# Altium project WiWi_USBStick.PrjPcb (part 3 of 5)

## Sheet 13-ESP32C6.SchDoc
size B; SheetNumber: 8; SheetTotal: 14
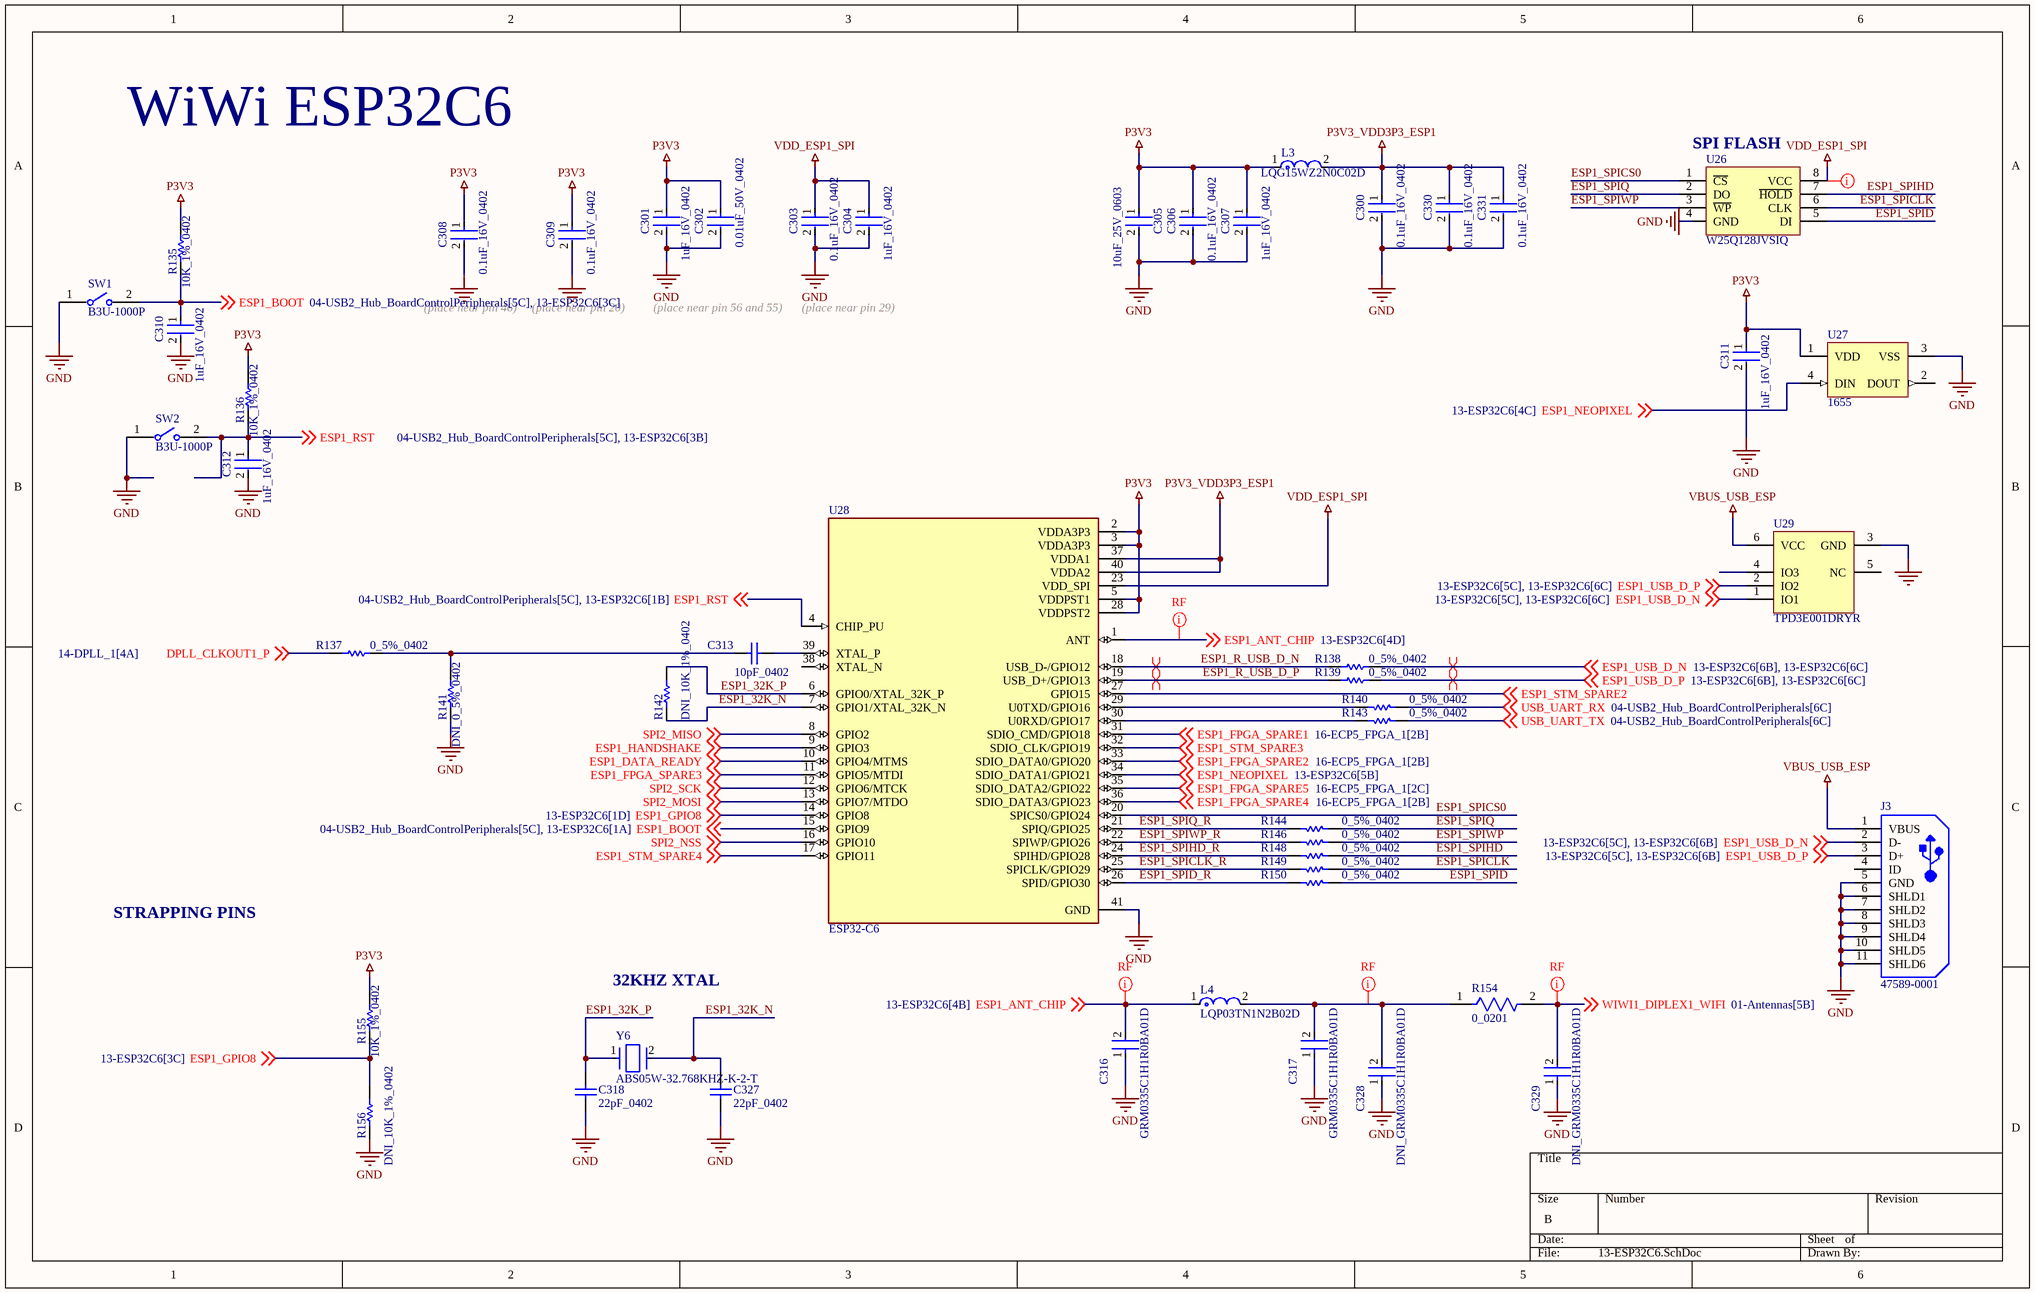
[diagram p7: 13-ESP32C6.SchDoc]

### Parts
C300  0.1uF_16V_0402  [FP-C0402-BB-MFG]
C301  1uF_16V_0402  [FP-0402-L_1_0_0_05-W_0_5-IPC_A]
C302  0.01uF_50V_0402  [FP-GCM155-0_05-IPC_C]
C303  0.1uF_16V_0402  [FP-C0402-BB-MFG]
C304  1uF_16V_0402  [FP-0402-L_1_0_0_05-W_0_5-IPC_A]
C305  10uF_25V_0603  [FP-CL10-IPC_C]
C306  0.1uF_16V_0402  [FP-C0402-BB-MFG]
C307  1uF_16V_0402  [FP-0402-L_1_0_0_05-W_0_5-IPC_A]
C308  0.1uF_16V_0402  [FP-C0402-BB-MFG]
C309  0.1uF_16V_0402  [FP-C0402-BB-MFG]
C310  1uF_16V_0402  [FP-0402-L_1_0_0_05-W_0_5-IPC_A]
C311  1uF_16V_0402  [FP-0402-L_1_0_0_05-W_0_5-IPC_A]
C312  1uF_16V_0402  [FP-0402-L_1_0_0_05-W_0_5-IPC_A]
C313  10pF_0402  [CAPC1005X55X25ML05T05]
C316  GRM0335C1H1R0BA01D  [FP-GRM033-0_03-IPC_C]
C317  GRM0335C1H1R0BA01D  [FP-GRM033-0_03-IPC_C]
C318  22pF_0402  [CAPC1005X55X25ML05T05]
C327  22pF_0402  [CAPC1005X55X25ML05T05]
C328  DNI_GRM0335C1H1R0BA01D  [FP-GRM033-0_03-IPC_C]  (no BOM)
C329  DNI_GRM0335C1H1R0BA01D  [FP-GRM033-0_03-IPC_C]  (no BOM)
C330  0.1uF_16V_0402  [FP-C0402-BB-MFG]
C331  0.1uF_16V_0402  [FP-C0402-BB-MFG]
J3  47589-0001  [MOLX-47589-0001_V]
L3  LQG15WZ2N0C02D  [FP-LQG15WH_02-IPC_B]
L4  LQP03TN1N2B02D  [FP-LQP03TG_02-IPC_A]
R135  10K_1%_0402  [RESC1005X40X25NL10T10]
R136  10K_1%_0402  [RESC1005X40X25NL10T10]
R137  0_5%_0402  [RESC1005X40X25NL05T10]
R138  0_5%_0402  [RESC1005X40X25NL05T10]
R139  0_5%_0402  [RESC1005X40X25NL05T10]
R140  0_5%_0402  [RESC1005X40X25NL05T10]
R141  DNI_0_5%_0402  [RESC1005X40X25NL05T10]  (no BOM)
R142  DNI_10K_1%_0402  [RESC1005X40X25NL10T10]  (no BOM)
R143  0_5%_0402  [RESC1005X40X25NL05T10]
R144  0_5%_0402  [RESC1005X40X25NL05T10]
R146  0_5%_0402  [RESC1005X40X25NL05T10]
R148  0_5%_0402  [RESC1005X40X25NL05T10]
R149  0_5%_0402  [RESC1005X40X25NL05T10]
R150  0_5%_0402  [RESC1005X40X25NL05T10]
R154  0_0201  [FP-RC_L0201-MFG]
R155  10K_1%_0402  [RESC1005X40X25NL10T10]
R156  DNI_10K_1%_0402  [RESC1005X40X25NL10T10]  (no BOM)
SW1  B3U-1000P  [FP-B3U-1000P-MFG]
SW2  B3U-1000P  [FP-B3U-1000P-MFG]
U26  W25Q128JVSIQ  [IC_W25Q128JVSIQ]
U27  1655  [ADA-RGB-1655_V]
U28  ESP32-C6  [QFN40P500X500X90-41N]
U29  TPD3E001DRYR  [DRY0006A]
Y6  ABS05W-32.768KHZ-K-2-T  [FP-ABS05W-MFG]

### Nets
GND: C300.2 C301.2 C302.2 C303.2 C304.2 C305.2 C306.2 C307.2 C308.2 C309.2 C310.2 C311.2 C312.2 C316.1 C317.1 C318.1 C327.1 C328.1 C329.1 C330.2 C331.2 J3.5(GND) J3.6(SHLD1) J3.7(SHLD2) J3.8(SHLD3) J3.9(SHLD4) J3.10(SHLD5) J3.11(SHLD6) R141.1 R156.1 SW1.1 SW2.1 U26.4(GND) U27.3(VSS) U28.41(GND) U29.3(GND)
P3V3: C301.1 C302.1 C305.1 C306.1 C307.1 C308.1 C309.1 C311.1 L3.1 R135.2 R136.2 R155.2 U27.1(VDD) U28.2(VDDA3P3) U28.3(VDDA3P3) U28.5(VDDPST1) U28.28(VDDPST2)
P3V3_VDD3P3_ESP1: C300.1 C330.1 C331.1 L3.2 U28.37(VDDA1) U28.40(VDDA2)
VBUS_USB_ESP: J3.1(VBUS) U29.6(VCC)
VDD_ESP1_SPI: C303.1 C304.1 U26.8(VCC) U28.23(VDD_SPI)
DPLL_CLKOUT1_P: R137.1 ; off-sheet DPLL_CLKOUT1_P
ESP1_32K_N: C327.2 R142.1 U28.7(GPIO1/XTAL_32K_N) Y6.2
ESP1_32K_P: C318.2 R142.2 U28.6(GPIO0/XTAL_32K_P) Y6.1
ESP1_ANT_CHIP: C316.2 L4.1 U28.1(ANT) ; off-sheet ESP1_ANT_CHIP
ESP1_BOOT: C310.1 R135.1 SW1.2 U28.15(GPIO9) ; off-sheet ESP1_BOOT
ESP1_DATA_READY: U28.10(GPIO4/MTMS) ; off-sheet ESP1_DATA_READY
ESP1_FPGA_SPARE1: U28.31(SDIO_CMD/GPIO18) ; off-sheet ESP1_FPGA_SPARE1
ESP1_FPGA_SPARE2: U28.33(SDIO_DATA0/GPIO20) ; off-sheet ESP1_FPGA_SPARE2
ESP1_FPGA_SPARE3: U28.11(GPIO5/MTDI) ; off-sheet ESP1_FPGA_SPARE3
ESP1_FPGA_SPARE4: U28.36(SDIO_DATA3/GPIO23) ; off-sheet ESP1_FPGA_SPARE4
ESP1_FPGA_SPARE5: U28.35(SDIO_DATA2/GPIO22) ; off-sheet ESP1_FPGA_SPARE5
ESP1_GPIO8: R155.1 R156.2 U28.14(GPIO8) ; off-sheet ESP1_GPIO8
ESP1_HANDSHAKE: U28.9(GPIO3) ; off-sheet ESP1_HANDSHAKE
ESP1_NEOPIXEL: U27.4(DIN) U28.34(SDIO_DATA1/GPIO21) ; off-sheet ESP1_NEOPIXEL
ESP1_R_USB_D_N: R138.1 U28.18(USB_D-/GPIO12)
ESP1_R_USB_D_P: R139.1 U28.19(USB_D+/GPIO13)
ESP1_RST: C312.1 R136.1 SW2.2 U28.4(CHIP_PU) ; off-sheet ESP1_RST
ESP1_SPICLK: R149.1 U26.6(CLK)
ESP1_SPICLK_R: R149.2 U28.25(SPICLK/GPIO29)
ESP1_SPICS0: U26.1(~{CS}) U28.20(SPICS0/GPIO24)
ESP1_SPID: R150.1 U26.5(DI)
ESP1_SPID_R: R150.2 U28.26(SPID/GPIO30)
ESP1_SPIHD: R148.1 U26.7(~{HOLD})
ESP1_SPIHD_R: R148.2 U28.24(SPIHD/GPIO28)
ESP1_SPIQ: R144.1 U26.2(DO)
ESP1_SPIQ_R: R144.2 U28.21(SPIQ/GPIO25)
ESP1_SPIWP: R146.1 U26.3(~{WP})
ESP1_SPIWP_R: R146.2 U28.22(SPIWP/GPIO26)
ESP1_STM_SPARE2: U28.27(GPIO15) ; off-sheet ESP1_STM_SPARE2
ESP1_STM_SPARE3: U28.32(SDIO_CLK/GPIO19) ; off-sheet ESP1_STM_SPARE3
ESP1_STM_SPARE4: U28.17(GPIO11) ; off-sheet ESP1_STM_SPARE4
ESP1_USB_D_N: J3.2(D-) R138.2 U29.1(IO1) ; off-sheet ESP1_USB_D_N
ESP1_USB_D_P: J3.3(D+) R139.2 U29.2(IO2) ; off-sheet ESP1_USB_D_P
SPI2_MISO: U28.8(GPIO2) ; off-sheet SPI2_MISO
SPI2_MOSI: U28.13(GPIO7/MTDO) ; off-sheet SPI2_MOSI
SPI2_NSS: U28.16(GPIO10) ; off-sheet SPI2_NSS
SPI2_SCK: U28.12(GPIO6/MTCK) ; off-sheet SPI2_SCK
USB_UART_RX: R140.1 ; off-sheet USB_UART_RX
USB_UART_TX: R143.1 ; off-sheet USB_UART_TX
WIWI1_DIPLEX1_WIFI: C329.2 R154.2 ; off-sheet WIWI1_DIPLEX1_WIFI
NetC313_1: C313.1 R137.2 R141.2
NetC313_2: C313.2 U28.39(XTAL_P)
NetC317_2: C317.2 C328.2 L4.2 R154.1
NetR140_2: R140.2 U28.29(U0TXD/GPIO16)
NetR143_2: R143.2 U28.30(U0RXD/GPIO17)

Not connected (* = marked no-connect by the designer): J3 4(ID); U27 2(DOUT); U28 38(XTAL_N); U29 4(IO3) 5(NC)

### Layout directives
net class Power: VDD_ESP1_SPI
net class RF: ESP1_ANT_CHIP, NetC317_2, WIWI1_DIPLEX1_WIFI
differential pair: ESP1_R_USB_D_N, ESP1_R_USB_D_P, ESP1_USB_D_N, ESP1_USB_D_P

### Notes on the sheet
- WiWi ESP32C6
- (near U26) SPI FLASH
- (place near pin 46)
- (place near pin 20)
- (place near pin 56 and 55)
- (place near pin 29)
- STRAPPING PINS
- 32KHZ XTAL

### Library data of the parts
C300 C303 C306 C308 C309 C330 C331 = CMP-1034-02068-3: CAP CER 0.1UF 16V 5% X7R 0402; Manufacturer: Kemet; Manufacturer Part Number: C0402C104J4RACTU; Value: 0.10 μF; Temperature Coefficient: 15%; Tolerance: 0.05; Material: Ceramic; ComponentLink2URL: https://content.kemet.com/datasheets/KEM_C1002_X7R_SMD.pdf; Automotive: No; Device Class L2: Capacitors; Temperature: -55°C to +125°C; RoHS: TRUE; Voltage Rating: 16 V; ComponentLink2Description: Datasheet; Device Class L3: Ceramic Capacitors; Temperature Range Low: -55°C; Ipc Land Pattern Name: CAPC10050X50; Device Class L1: Passive Components; Temperature Range High: +125°C; Package: C0402-BB; Capacitance: 0.10 μF; Category: Cap; Mouser Description: CAP CER 0.1UF 16V X7R 0402; Height: 0.55mm; Digikey Description: CAP CER 0.1UF 16V 5% X7R 0402; Octopart: https://octopart.com/c0402c104j4ractu-kemet-12573893; Temperature Characteristic: X7R; Lead Free: Yes
C301 C304 C307 C310-C312 = CMP-14477-000104-2: None; Tolerance: 10%; Voltage Rating: 16V; Dielectric: X5R; Capacitance: 1uF; Packaging: Tape and Reel; Depth: 0.5mm; Mount: Surface Mount; Thickness: 0.022inch; Package Quantity: 1; Min Operating Temperature: -55°C; Series: M; Voltage Rating (DC): 16V; Termination: SMD/SMT; Case/Package: 0402; Number of Pins: 2; Case Code (Imperial): 0402; Length: 1mm; Halogen Free: Halogen Free; Case Code (Metric): 1005; Width: 0.02inch; RoHS Compliant: Yes; Radiation Hardening: No; Max Operating Temperature: 85°C; Height: 0.5mm; Construction: Flat
C302 = CMP-2008-03723-3: Ceramic Capacitor for Automotive 10nF ±10% 50VDC X7R 0402 Paper T/R; Voltage Rating (DC): 50V; Min Operating Temperature: -55°C; Radiation Hardening: No; Mount: Surface Mount; Thickness: 0.022inch; Package Quantity: 1; Case Code (Imperial): 0402; Lead Free: Lead Free; Case/Package: 0402; Depth: 0.5mm; Termination: SMD/SMT; Tolerance: 10%; Voltage: 50V; Packaging: Tape and Reel; Width: 0.02inch; REACH SVHC: No SVHC; Height: 0.5mm; Max Operating Temperature: 125°C; Case Code (Metric): 1005; Voltage Rating: 50V; Capacitance: 10nF; Ratings: AEC-Q200; Length: 1mm; Dielectric: X7R
C305 = CMP-13271-004224-1: Cap Ceramic 10uF 25V X5R ±20% Pad SMD 0603 +85°C T/R; Width: 0.031inch; Voltage Rating: 25V; Length: 0.063inch; Case Code (Metric): 1608; Dielectric: X5R; Termination: Wraparound; Capacitance: 10uF; Lead Free: Lead Free; Mount: Surface Mount; Package Quantity: 1; Case Code (Imperial): 0603; Thickness: 0.035inch; Packaging: Tape and Reel; Contact Plating: Tin; Min Operating Temperature: -55°C; Tolerance: 20%; Max Operating Temperature: 85°C; Case/Package: 0603
C313 = CMP-2100-03589-1: Chip Capacitor, 10 pF, +/- 5%, 50 V, -55 to 125 degC, 0402 (1005 Metric), RoHS, Tape and Reel; Manufacturer: Yageo; Insulation Resistance: 100GR; Voltage Rating (DC): 50V; Dielectric Material: Ceramic; Temperature Coefficient: 30ppm/degC; Dielectric: C0G; Capacitance: 10pF; Termination: SMD/SMT; Package Reference: 0402; Lead Free: LeadFree; Composition: Ceramic; Tolerance: 5%; Case Code (Metric): 1005; Voltage Rating: 50V; Packaging: TapeandReel; Manufacturer URL: http://www.yageo.com/; REACH SVHC: NoSVHC; Max Operating Temperature: 125degC; Length: 1mm; Mount: SurfaceMount; Depth: 0.5mm; Min Operating Temperature: -55degC; Number of Pins: 2; Width: 0.02inch; Datasheet Version: Rev. 14, 07/2016; Package Quantity: 1; Datasheet URL: http://www.yageo.com/documents/recent/UPY-GP_NP0_16V-to-50V_14.pdf; Case Code (Imperial): 0402; RoHSCompliant: True; Radiation Hardening: No; Height: 0.5mm; Case/Package: 0402; Thickness: 0.022inch; Package Description: 2-Pin Surface Mount Device, Body 1 x 0.5 mm; Voltage: 50V
C316 C317 C328 C329 = CMP-2010-01509-2: Chip Multilayer Ceramic Capacitors for General Purpose, 0201, 1.0pF, C0G, 30ppm/°C, 0.1pF, 50V; Capacitance: 1pF; Termination: SMD/SMT; Depth: 0.3mm; Mount: Surface Mount; Case Code (Metric): 0603; Length: 0.024inch; Voltage Rating: 50V; Voltage Rating (DC): 50V; Width: 0.012inch; Lead Free: Lead Free; Dielectric: C0G; Thickness: 0.013inch; Packaging: Tape and Reel; Case Code (Imperial): 0201; Case/Package: 0201; Package Quantity: 15000; Min Operating Temperature: -55°C; Max Operating Temperature: 125°C
C318 C327 = CMP-2100-03590-1: Chip Capacitor, 22 pF, +/- 5%, 50 V, -55 to 125 degC, 0402 (1005 Metric), RoHS, Tape and Reel; Manufacturer: Yageo; Voltage Rating: 50V; Dielectric Material: Ceramic; Capacitance: 22pF; Temperature Coefficient: 30ppm/degC; Dielectric: C0G; Insulation Resistance: 100GR; Datasheet URL: http://www.yageo.com/NewPortal/yageodocoutput?fileName=/pdf/MLCC/UPY-GP_NP0_16V-to-50V_14.pdf; Depth: 0.5mm; Number of Pins: 2; Height: 0.5mm; Min Operating Temperature: -55degC; REACH SVHC: NoSVHC; Max Operating Temperature: 125degC; Voltage Rating (DC): 50V; Composition: Ceramic; Packaging: TapeandReel; Package Quantity: 1; Package Reference: 0402; Length: 1mm; Radiation Hardening: No; Package Description: 2-Pin Surface Mount Device, Body 1 x 0.5 mm; RoHSCompliant: True; Thickness: 0.022inch; Manufacturer URL: http://www.yageo.com/; Mount: SurfaceMount; Case Code (Metric): 1005; Case/Package: 0402; Tolerance: 5%; Termination: SMD/SMT; Width: 0.02inch; Datasheet Version: Rev. 14, 07/2016; Lead Free: LeadFree; Case Code (Imperial): 0402
J3 = CMP-2000-05610-1: Right Angle Female Type AB Micro USB Connector, 30 V, 1.8 A, -30 to 85 degC, RoHS, Tape and Reel; Number of Ports: 1Port; Current Rating: 1.8A; Brand: Molex; Connector Type: MicroUSBTypeABreceptacle; Number of Contacts: 5Contact; Voltage Rating: 30VAC; Color: Black; Product: MicroUSBTypeABConnectors; Package URL: http://www.molex.com/pdm_docs/sd/475890001_sd.pdf; Contact Plating: Gold; Datasheet URL: http://www.molex.com/webdocs/datasheets/pdf/en-us/0475890001_IO_CONNECTORS.pdf; Operating Temperature Range: -20Cto+85C; Termination Style: SMD/SMT; Mounting Angle: Right; Package Reference: 47589-0001; Gender: Female; Package Description: Micro USB Connector, Pitch 0.65 mm, 5 Positions, Body 7.5 x 5.6 mm; Mounting Technology: SurfaceMount; Contact Material: CopperAlloy; Packaging: Reel; RoHS: True; Standard: USB; Manufacturer URL: http://www.molex.com/; Manufacturer: Molex; Datasheet Version: 12/2016; Product Category: USBConnectors; Series: 47589
L3 = CMP-06042-012509-1: Multilayer type Inductor for Automotive 2nH ±0.2nH 0.05Ω 1000mA 0402; Test Frequency: 100MHz; Shielding: Unshielded; DC Resistance (DCR): 50mR; Self Resonant Frequency: 8GHz; Current Rating: 1A; Core Material: Air; Case Code (Metric): 1005; Case/Package: 0402; Mount: Surface Mount; Min Operating Temperature: -55°C; Inductance: 2nH; Ratings: AEC-Q200; Max Operating Temperature: 125°C; Packaging: Cut Tape; Case Code (Imperial): 0402
L4 = CMP-06042-001577-1: Film type RF Inductor 1.2nH ±0.1nH 750mA 0.1Ω 0201 (0603); DC Resistance (DCR): 100mR; Current: 600mA; Core Material: Non-Magnetic; Shielding: Unshielded; Q Factor: 14; Test Frequency: 500MHz; Self Resonant Frequency: 6GHz; Inductance: 1.2nH; Mount: Surface Mount; Package Quantity: 15000; Length: 0.024inch; Resistor Type: Thin Film; Min Operating Temperature: -55°C; Depth: 0.33mm; Height: 0.012inch; Max DC Current: 750mA; Width: 0.012inch; Case/Package: 0201; Case Code (Imperial): 0201; Lead Free: Lead Free; Military Standard: Not; Termination: SMD/SMT; Max Operating Temperature: 125°C; DC Current: 750mA; Packaging: Tape and Reel; Case Code (Metric): 0603; Height - Seated (Max): 0.013inch; REACH SVHC: No SVHC; Radiation Hardening: No; Current Rating: 750mA
R135 R136 R142 R155 R156 = CMP-2002-04694-1: Manufacturer: Bourns; Part Number: CR0402-FX-1002GLF
R137-R141 R143 R144 R146 R148-R150 = CMP-2002-06457-1: Manufacturer: Panasonic; Part Number: ERJ-U020R00X
R154 = CMP-03412-023265-1: RES SMD 0 OHM JUMPER 1/20W 0201; Manufacturer: Yageo; Manufacturer Part Number: RC0201JR-070RL; Power Rating: 50mW; Value: 0Ω; Temperature Coefficient: 200ppm/°C; Voltage Rating: 25V; Tolerance: 5%; Octopart: https://octopart.com/rc0201jr-070rl-yageo-43171986; ComponentLink2URL: http://www.yageo.com/documents/recent/PYu-RC_Group_51_RoHS_L_10.pdf; Device Class L2: Resistors; Series: RC_L; Ipc Land Pattern Name: RESC6030X23; Temperature: -55°C to +125°C; Mouser Description: Thick Film Resistors ZERO OHM JUMPER; Footprint Url: http://www.yageo.com/exep/pages/download/literatures/PYu-R_Mount_10.pdf; RoHS: TRUE; Package: RC_L0201; Device Class L3: Chip SMD Resistors; Temperature Range Low: -55°C; Composition: Thick Film; ComponentLink2Description: Datasheet; Height: 0.26mm; Device Class L1: Passive Components; Category: Res; Resistance: 0Ω; Temperature Range High: +125°C; Automotive: No; Lead Free: Yes; Digikey Description: RES SMD 0 OHM JUMPER 1/20W 0201
SW1 SW2 = CMP-2100-03586-2: SWITCH TACTILE SPST-NO 0.05A 12V; Contact Resistance: 100mR; Operating Force: 1.5N; Max Current Rating: 50mA; Switch Travel: 0.15mm; Actuator Type: Standard; Mechanical Life: 200000Cycles; Ratings: Dust Proof; Illumination Type: Non-Illuminated; Throw Configuration: SPST; Actuator Length: 0.4mm; Switch Function: Off-Mom; Height: 1.2mm; Width: 3mm; Weight: 0.000776oz; Contact Material: Silver; Max Voltage Rating (DC): 12V; Insulation Resistance: 100MR; Lead Free: Lead Free; Current Rating: 50mA; Termination: SMD/SMT; Length: 4mm; Voltage Rating (DC): 12V; Contact Current Rating: 50mA; Orientation: Straight; Depth: 2.5mm; Max Operating Temperature: 70°C; Packaging: Tape and Reel; Min Operating Temperature: -25°C; Package Quantity: 1; Mount: Surface Mount; Electrical Life: 200000Cycles
U26 = IC_W25Q128JVSIQ: NOR Flash Serial (SPI, Dual SPI, Quad SPI) 3.3V 128M-bit 16M x 8 6ns 8-Pin SOIC Tube; Manufacturer: Winbond; Memory Format: Non-Volatile,FLASH; Frequency: 133MHz; Memory Size: 128Mb; Supplier 1: Digi-Key; Manufacturer Part Number: W25Q128JVSIQ; RoHS: Yes; Category: Flash; Stock 1: 154352; Pricing 1: 1=1.71, 10=1.562, 25=1.52, 50=1.5124, 100=1.3519, 250=1.348, 500=1.32762, 1000=1.27127, 5000=1.18359 (USD); Mounting Technology: Surface Mount; Case/Package: SOIC; Min Operating Temperature: -40°C; Max Operating Temperature: 85°C; Packaging: Tray; Series: SpiFlash®; RoHS Compliant: Yes; ComponentLink1URL: http://www.winbond.com/resource-files/w25q128jv%20revf%2003272018%20plus.pdf?src-supplier=Digi-Key; ComponentLink1Description: http://www.winbond.com/resource-files/w25q128jv%20revf%2003272018%20plus.pdf?src-supplier=Digi-Key; Supplier Part Number 1: W25Q128JVSIQ-ND
U27 = CMP-2000-05026-1: Intelligent Control LED Integrated Light Source, 3.5 to 5.3 V, -25 to 80 degC, 4-Pin SMD, RoHS, Tape and Reel; Manufacturer: Adafruit-Industries-LLC; Number of LEDs: 10; Configuration: Discrete; Utilized LED: WS2812(5050); Datasheet URL: http://datasheet.octopart.com/ADA1655-Adafruit-Industries-datasheet-32028139.pdf; Series: Neopixel; Interface: -; Package Description: 4-Pin Surface Mount Device, Body 5 x 5 mm; Color: Red,Green,Blue(RGB); Category: Optoelectronics; Controller Type: -; Package Reference: 1655; Manufacturer URL: https://www.adafruit.com/; Mounting Type: SurfaceMount; Datasheet Version: May-13; Size / Dimension: 5.00mmLx5.00mmW; Family: Addressable,Specialty
U28 = ESP32-C6: IC RF TxRx Only Bluetooth, WiFi Bluetooth v5.0, Thread, ZigbeeÂ® 2.412GHz ~ 2.484GHz 40-VFQFN Exposed Pad; MF: Espressif Systems; SnapEDA_Link: https://www.snapeda.com/parts/ESP32-C6/Espressif+Systems/view-part/?ref=snap; Package: None; Value: *; MP: ESP32-C6; Check_prices: https://www.snapeda.com/parts/ESP32-C6/Espressif+Systems/view-part/?ref=eda
U29 = CMP-0326-00032-3: Low-Capacitance + / - 15 kV ESD-Protection Array for High-Speed Data Interfaces, 3 Channels, -40 to +85 degC, 6-pin SON (DRY), Green (RoHS & no Sb/Br); Manufacturer: Texas Instruments; USB High Speed: TRUE; SubFamily: ESD Solution; IO Capacitance(Typ)(pF): 1.5; IEC 61000-4-2 Contact(+/- kV): 8; IO Leakage Current(nA): Jan-00; Breakdown Voltage(Min)(V): 11; IEC 61000-4-2 Air-Gap(+/- kV): 15; DatasheetVersion: SLLS683D; Mounting Technology: Surface Mount; ComponentLink1URL: http://www.ti.com/; PackageReference: DRY0006A; ComponentLink2URL: http://www.ti.com/general/docs/lit/getliterature.tsp?genericPartNumber=TPD3E001&fileType=pdf; ComponentLink2Description: Datasheet; ComponentLink3Description: URL Link1; PackageDescription: 6-Pin Plastic Small Outline No-Lead, 1 x 1.45 x 0.6 mm Body, 0.5 mm Pitch; ComponentLink1Description: Manufacturer URL; PackageVersion: revF, Dec-2011; PartNumber: TPD3E001DRYR; Eco-Plan: Green (RoHS & no Sb/Br); ComponentLink3URL: SamplesURL:http://www.ti.com/product/tpd3e001#samples
Y6 = CMP-27762-015607-1: Crystal 32.768kHz ±20ppm (Tol) 4pF 85kΩ 2-Pin SMD T/R; ESR (Equivalent Series Resistance): 85kR; Frequency Tolerance: 20ppm; Mount: Surface Mount; Load Capacitance: 4pF; Case/Package: SMD/SMT; Packaging: Cut Tape; Frequency: 32.768kHz; Series: ABS05W; Min Operating Temperature: -40°C; Max Operating Temperature: 125°C

## Sheet 14-DPLL_1.SchDoc
size C; SheetNumber: 9; SheetTotal: 14
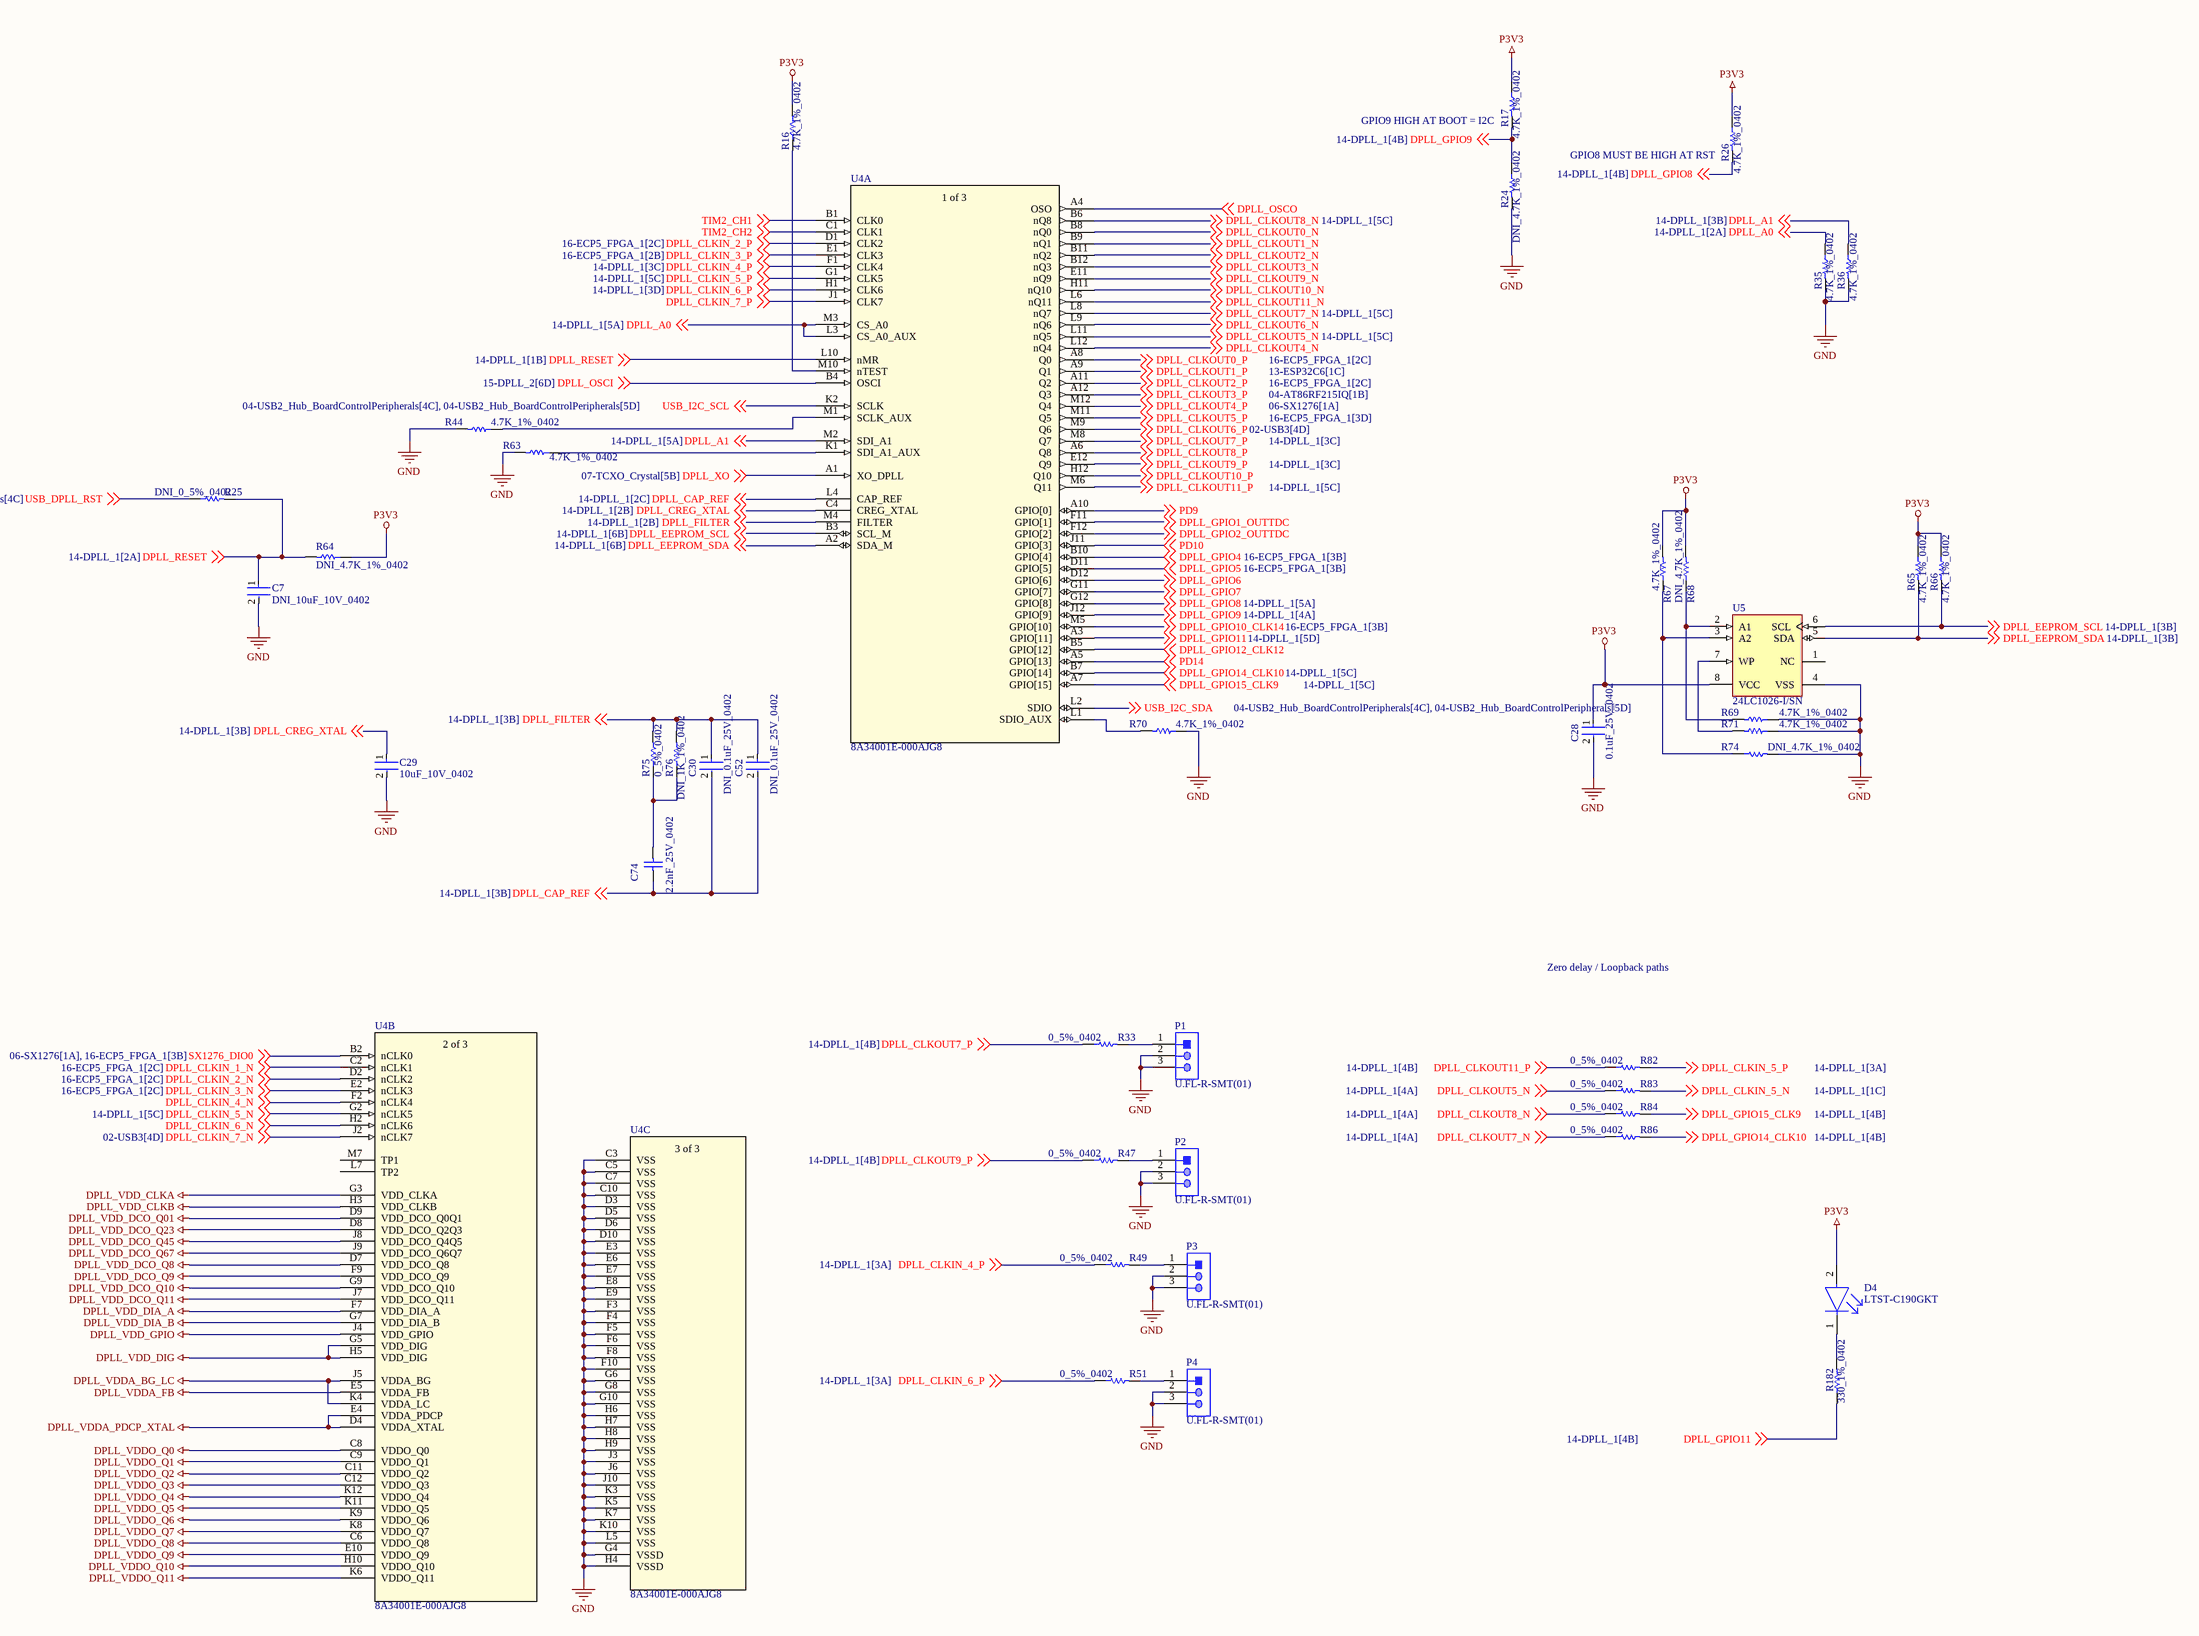
[diagram p8: 14-DPLL_1.SchDoc]

### Parts
C7  DNI_10uF_10V_0402  [FP-CL05A106MP5NUNC-MFG]  (no BOM)
C28  0.1uF_25V_0402  [FP-0402-L_1_0_1-W_0_5_0_1-IPC_C]
C29  10uF_10V_0402  [FP-CL05A106MP5NUNC-MFG]
C30  DNI_0.1uF_25V_0402  [FP-0402-L_1_0_1-W_0_5_0_1-IPC_C]  (no BOM)
C52  DNI_0.1uF_25V_0402  [FP-0402-L_1_0_1-W_0_5_0_1-IPC_C]  (no BOM)
C74  2.2nF_25V_0402  [CAPC1005X56X25LL10T15]
D4  LTST-C190GKT  [FP-LTST-C190GKT-MFG]
P1  U.FL-R-SMT(01)  [HRS-U.FL-R-SMT(10)_V]
P2  U.FL-R-SMT(01)  [HRS-U.FL-R-SMT(10)_V]
P3  U.FL-R-SMT(01)  [HRS-U.FL-R-SMT(10)_V]
P4  U.FL-R-SMT(01)  [HRS-U.FL-R-SMT(10)_V]
R16  4.7K_1%_0402  [RESC1005X40X25NL10T10]
R17  4.7K_1%_0402  [RESC1005X40X25NL10T10]
R24  DNI_4.7K_1%_0402  [RESC1005X40X25NL10T10]  (no BOM)
R25  DNI_0_5%_0402  [RESC1005X40X25LL10T10]  (no BOM)
R26  4.7K_1%_0402  [RESC1005X40X25NL10T10]
R33  0_5%_0402  [RESC1005X40X25LL10T10]
R35  4.7K_1%_0402  [RESC1005X40X25NL10T10]
R36  4.7K_1%_0402  [RESC1005X40X25NL10T10]
R44  4.7K_1%_0402  [RESC1005X40X25NL10T10]
R47  0_5%_0402  [RESC1005X40X25LL10T10]
R49  0_5%_0402  [RESC1005X40X25LL10T10]
R51  0_5%_0402  [RESC1005X40X25LL10T10]
R63  4.7K_1%_0402  [RESC1005X40X25NL10T10]
R64  DNI_4.7K_1%_0402  [RESC1005X40X25NL10T10]  (no BOM)
R65  4.7K_1%_0402  [RESC1005X40X25NL10T10]
R66  4.7K_1%_0402  [RESC1005X40X25NL10T10]
R67  4.7K_1%_0402  [RESC1005X40X25NL10T10]
R68  DNI_4.7K_1%_0402  [RESC1005X40X25NL10T10]  (no BOM)
R69  4.7K_1%_0402  [RESC1005X40X25NL10T10]
R70  4.7K_1%_0402  [RESC1005X40X25NL10T10]
R71  4.7K_1%_0402  [RESC1005X40X25NL10T10]
R74  DNI_4.7K_1%_0402  [RESC1005X40X25NL10T10]  (no BOM)
R75  0_5%_0402  [RESC1005X40X25LL10T10]
R76  DNI_1K_1%_0402  [RESC1005X40X25NL05T05]  (no BOM)
R82  0_5%_0402  [RESC1005X40X25LL10T10]
R83  0_5%_0402  [RESC1005X40X25LL10T10]
R84  0_5%_0402  [RESC1005X40X25LL10T10]
R86  0_5%_0402  [RESC1005X40X25LL10T10]
R182  330_1%_0402  [RESC1005X40X25NL10T10]
U4  8A34001E-000AJG8  [144-CABGA_REN]  (parts A,B,C of 3)
U5  24LC1026-I/SN  [MCHP-SOIC-SN8_N]

### Nets
DPLL_VDD_CLKA: U4.G3(VDD_CLKA)
DPLL_VDD_CLKB: U4.H3(VDD_CLKB)
DPLL_VDD_DCO_Q01: U4.D9(VDD_DCO_Q0Q1)
DPLL_VDD_DCO_Q8: U4.D7(VDD_DCO_Q8)
DPLL_VDD_DCO_Q9: U4.F9(VDD_DCO_Q9)
DPLL_VDD_DCO_Q10: U4.G9(VDD_DCO_Q10)
DPLL_VDD_DCO_Q11: U4.J7(VDD_DCO_Q11)
DPLL_VDD_DCO_Q23: U4.D8(VDD_DCO_Q2Q3)
DPLL_VDD_DCO_Q45: U4.J8(VDD_DCO_Q4Q5)
DPLL_VDD_DCO_Q67: U4.J9(VDD_DCO_Q6Q7)
DPLL_VDD_DIA_A: U4.F7(VDD_DIA_A)
DPLL_VDD_DIA_B: U4.G7(VDD_DIA_B)
DPLL_VDD_DIG: U4.G5(VDD_DIG) U4.H5(VDD_DIG)
DPLL_VDD_GPIO: U4.J4(VDD_GPIO)
DPLL_VDDA_BG_LC: U4.J5(VDDA_BG) U4.K4(VDDA_LC)
DPLL_VDDA_FB: U4.E5(VDDA_FB)
DPLL_VDDA_PDCP_XTAL: U4.D4(VDDA_XTAL) U4.E4(VDDA_PDCP)
DPLL_VDDO_Q0: U4.C8(VDDO_Q0)
DPLL_VDDO_Q1: U4.C9(VDDO_Q1)
DPLL_VDDO_Q2: U4.C11(VDDO_Q2)
DPLL_VDDO_Q3: U4.C12(VDDO_Q3)
DPLL_VDDO_Q4: U4.K12(VDDO_Q4)
DPLL_VDDO_Q5: U4.K11(VDDO_Q5)
DPLL_VDDO_Q6: U4.K9(VDDO_Q6)
DPLL_VDDO_Q7: U4.K8(VDDO_Q7)
DPLL_VDDO_Q8: U4.C6(VDDO_Q8)
DPLL_VDDO_Q9: U4.E10(VDDO_Q9)
DPLL_VDDO_Q10: U4.H10(VDDO_Q10)
DPLL_VDDO_Q11: U4.K6(VDDO_Q11)
GND: C7.2 C28.2 C29.2 P1.2 P1.3 P2.2 P2.3 P3.2 P3.3 P4.2 P4.3 R24.2 R35.2 R36.2 R44.2 R63.2 R69.1 R70.1 R71.1 R74.2 U4.C3(VSS) U4.C5(VSS) U4.C7(VSS) U4.C10(VSS) U4.D3(VSS) U4.D5(VSS) U4.D6(VSS) U4.D10(VSS) U4.E3(VSS) U4.E6(VSS) U4.E7(VSS) U4.E8(VSS) U4.E9(VSS) U4.F3(VSS) U4.F4(VSS) U4.F5(VSS) U4.F6(VSS) U4.F8(VSS) U4.F10(VSS) U4.G4(VSSD) U4.G6(VSS) U4.G8(VSS) U4.G10(VSS) U4.H4(VSSD) U4.H6(VSS) U4.H7(VSS) U4.H8(VSS) U4.H9(VSS) U4.J3(VSS) U4.J6(VSS) U4.J10(VSS) U4.K3(VSS) U4.K5(VSS) U4.K7(VSS) U4.K10(VSS) U4.L5(VSS) U5.4(VSS)
P3V3: C28.1 D4.2(A) R16.2 R17.1 R26.1 R64.1 R65.1 R66.1 R67.2 R68.2 U5.8(VCC)
DPLL_A0: R35.1 U4.L3(CS_A0_AUX) U4.M3(CS_A0) ; off-sheet DPLL_A0
DPLL_A1: R36.1 U4.M2(SDI_A1) ; off-sheet DPLL_A1
DPLL_CAP_REF: C30.2 C52.2 C74.1 U4.L4(CAP_REF) ; off-sheet DPLL_CAP_REF
DPLL_CLKIN_1_N: U4.C2(nCLK1) ; off-sheet DPLL_CLKIN_1_N
DPLL_CLKIN_2_N: U4.D2(nCLK2) ; off-sheet DPLL_CLKIN_2_N
DPLL_CLKIN_2_P: U4.D1(CLK2) ; off-sheet DPLL_CLKIN_2_P
DPLL_CLKIN_3_N: U4.E2(nCLK3) ; off-sheet DPLL_CLKIN_3_N
DPLL_CLKIN_3_P: U4.E1(CLK3) ; off-sheet DPLL_CLKIN_3_P
DPLL_CLKIN_4_N: U4.F2(nCLK4) ; off-sheet DPLL_CLKIN_4_N
DPLL_CLKIN_4_P: R49.1 U4.F1(CLK4) ; off-sheet DPLL_CLKIN_4_P
DPLL_CLKIN_5_N: R83.2 U4.G2(nCLK5) ; off-sheet DPLL_CLKIN_5_N
DPLL_CLKIN_5_P: R82.2 U4.G1(CLK5) ; off-sheet DPLL_CLKIN_5_P
DPLL_CLKIN_6_N: U4.H2(nCLK6) ; off-sheet DPLL_CLKIN_6_N
DPLL_CLKIN_6_P: R51.1 U4.H1(CLK6) ; off-sheet DPLL_CLKIN_6_P
DPLL_CLKIN_7_N: U4.J2(nCLK7) ; off-sheet DPLL_CLKIN_7_N
DPLL_CLKIN_7_P: U4.J1(CLK7) ; off-sheet DPLL_CLKIN_7_P
DPLL_CLKOUT0_N: U4.B8(nQ0) ; off-sheet DPLL_CLKOUT0_N
DPLL_CLKOUT0_P: U4.A8(Q0) ; off-sheet DPLL_CLKOUT0_P
DPLL_CLKOUT1_N: U4.B9(nQ1) ; off-sheet DPLL_CLKOUT1_N
DPLL_CLKOUT1_P: U4.A9(Q1) ; off-sheet DPLL_CLKOUT1_P
DPLL_CLKOUT2_N: U4.B11(nQ2) ; off-sheet DPLL_CLKOUT2_N
DPLL_CLKOUT2_P: U4.A11(Q2) ; off-sheet DPLL_CLKOUT2_P
DPLL_CLKOUT3_N: U4.B12(nQ3) ; off-sheet DPLL_CLKOUT3_N
DPLL_CLKOUT3_P: U4.A12(Q3) ; off-sheet DPLL_CLKOUT3_P
DPLL_CLKOUT4_N: U4.L12(nQ4) ; off-sheet DPLL_CLKOUT4_N
DPLL_CLKOUT4_P: U4.M12(Q4) ; off-sheet DPLL_CLKOUT4_P
DPLL_CLKOUT5_N: R83.1 U4.L11(nQ5) ; off-sheet DPLL_CLKOUT5_N
DPLL_CLKOUT5_P: U4.M11(Q5) ; off-sheet DPLL_CLKOUT5_P
DPLL_CLKOUT6_N: U4.L9(nQ6) ; off-sheet DPLL_CLKOUT6_N
DPLL_CLKOUT6_P: U4.M9(Q6) ; off-sheet DPLL_CLKOUT6_P
DPLL_CLKOUT7_N: R86.1 U4.L8(nQ7) ; off-sheet DPLL_CLKOUT7_N
DPLL_CLKOUT7_P: R33.1 U4.M8(Q7) ; off-sheet DPLL_CLKOUT7_P
DPLL_CLKOUT8_N: R84.1 U4.B6(nQ8) ; off-sheet DPLL_CLKOUT8_N
DPLL_CLKOUT8_P: U4.A6(Q8) ; off-sheet DPLL_CLKOUT8_P
DPLL_CLKOUT9_N: U4.E11(nQ9) ; off-sheet DPLL_CLKOUT9_N
DPLL_CLKOUT9_P: R47.1 U4.E12(Q9) ; off-sheet DPLL_CLKOUT9_P
DPLL_CLKOUT10_N: U4.H11(nQ10) ; off-sheet DPLL_CLKOUT10_N
DPLL_CLKOUT10_P: U4.H12(Q10) ; off-sheet DPLL_CLKOUT10_P
DPLL_CLKOUT11_N: U4.L6(nQ11) ; off-sheet DPLL_CLKOUT11_N
DPLL_CLKOUT11_P: R82.1 U4.M6(Q11) ; off-sheet DPLL_CLKOUT11_P
DPLL_CREG_XTAL: C29.1 U4.C4(CREG_XTAL) ; off-sheet DPLL_CREG_XTAL
DPLL_EEPROM_SCL: R66.2 U4.B3(SCL_M) U5.6(SCL) ; off-sheet DPLL_EEPROM_SCL
DPLL_EEPROM_SDA: R65.2 U4.A2(SDA_M) U5.5(SDA) ; off-sheet DPLL_EEPROM_SDA
DPLL_FILTER: C30.1 C52.1 R75.2 R76.2 U4.M4(FILTER) ; off-sheet DPLL_FILTER
DPLL_GPIO1_OUTTDC: U4.F11(GPIO[1]) ; off-sheet DPLL_GPIO1_OUTTDC
DPLL_GPIO2_OUTTDC: U4.F12(GPIO[2]) ; off-sheet DPLL_GPIO2_OUTTDC
DPLL_GPIO4: U4.B10(GPIO[4]) ; off-sheet DPLL_GPIO4
DPLL_GPIO5: U4.D11(GPIO[5]) ; off-sheet DPLL_GPIO5
DPLL_GPIO6: U4.D12(GPIO[6]) ; off-sheet DPLL_GPIO6
DPLL_GPIO7: U4.G11(GPIO[7]) ; off-sheet DPLL_GPIO7
DPLL_GPIO8: R26.2 U4.G12(GPIO[8]) ; off-sheet DPLL_GPIO8
DPLL_GPIO9: R17.2 R24.1 U4.J12(GPIO[9]) ; off-sheet DPLL_GPIO9
DPLL_GPIO10_CLK14: U4.M5(GPIO[10]) ; off-sheet DPLL_GPIO10_CLK14
DPLL_GPIO11: R182.1 U4.A3(GPIO[11]) ; off-sheet DPLL_GPIO11
DPLL_GPIO12_CLK12: U4.B5(GPIO[12]) ; off-sheet DPLL_GPIO12_CLK12
DPLL_GPIO14_CLK10: R86.2 U4.B7(GPIO[14]) ; off-sheet DPLL_GPIO14_CLK10
DPLL_GPIO15_CLK9: R84.2 U4.A7(GPIO[15]) ; off-sheet DPLL_GPIO15_CLK9
DPLL_OSCI: U4.B4(OSCI) ; off-sheet DPLL_OSCI
DPLL_OSCO: U4.A4(OSO) ; off-sheet DPLL_OSCO
DPLL_RESET: C7.1 R25.2 R64.2 U4.L10(nMR) ; off-sheet DPLL_RESET
DPLL_XO: U4.A1(XO_DPLL) ; off-sheet DPLL_XO
PD9: U4.A10(GPIO[0]) ; off-sheet PD9
PD10: U4.J11(GPIO[3]) ; off-sheet PD10
PD14: U4.A5(GPIO[13]) ; off-sheet PD14
SX1276_DIO0: U4.B2(nCLK0) ; off-sheet SX1276_DIO0
TIM2_CH1: U4.B1(CLK0) ; off-sheet TIM2_CH1
TIM2_CH2: U4.C1(CLK1) ; off-sheet TIM2_CH2
USB_DPLL_RST: R25.1 ; off-sheet USB_DPLL_RST
USB_I2C_SCL: U4.K2(SCLK) ; off-sheet USB_I2C_SCL
USB_I2C_SDA: U4.L2(SDIO) ; off-sheet USB_I2C_SDA
NetC74_2: C74.2 R75.1 R76.1
NetD4_1: D4.1(C) R182.2
NetP1_1: P1.1 R33.2
NetP2_1: P2.1 R47.2
NetP3_1: P3.1 R49.2
NetP4_1: P4.1 R51.2
NetR16_1: R16.1 U4.M10(nTEST)
NetR44_1: R44.1 U4.M1(SCLK_AUX)
NetR63_1: R63.1 U4.K1(SDI_A1_AUX)
NetR67_1: R67.1 R74.1 U5.3(A2)
NetR68_1: R68.1 R69.2 U5.2(A1)
NetR70_2: R70.2 U4.L1(SDIO_AUX)
NetR71_2: R71.2 U5.7(WP)

Not connected (* = marked no-connect by the designer): U4 L7(TP2) M7(TP1); U5 1(NC)

### Notes on the sheet
- (near R17) GPIO9 HIGH AT BOOT = I2C
- (near R26) GPIO8 MUST BE HIGH AT RST
- Zero delay / Loopback paths
- (in symbol 8A34001E-000AJG8, part A) 1 of 3
- (in symbol 8A34001E-000AJG8, part B) 2 of 3
- (in symbol 8A34001E-000AJG8, part C) 3 of 3

### Library data of the parts
C7 C29 = CMP-13271-000002-1: CAP CER 10UF 10V X5R 0402; Manufacturer Part Number: CL05A106MP5NUNC; Manufacturer: Samsung; Temperature Coefficient: 15%; Tolerance: 20%; Material: Ceramic; Octopart: https://octopart.com/cl05a106mp5nunc-samsung-22457395; Voltage Rating: 10V; RoHS: TRUE; Value: 10uF; Height: 0.7mm; Digikey Description: CAP CER 10UF 10V X5R 0402; Automotive: No; Package: CL05A106MP5NUNC; Device Class L1: Passive Components; Capacitance: 10uF; Temperature Range High: +85°C; ComponentLink2Description: Datasheet; Device Class L2: Capacitors; Temperature Characteristic: X5R; Temperature: -55°C to +85°C; ComponentLink2URL: http://www.samsungsem.com/kr/support/product-search/mlcc/__icsFiles/afieldfile/2019/05/10/19-CL05A106MP5NUNC.pdf; Device Class L3: Ceramic Capacitors; Category: Cap; Temperature Range Low: -55°C; Ipc Land Pattern Name: CAPC10050X50; Lead Free: Yes
C28 C30 C52 = CMP-2008-02519-2: General Purpose Ceramic Capacitor, 0402, 100nF, 10%, X7R, 15%, 25V; Package Quantity: 1; Capacitance: 100nF; Min Operating Temperature: -55°C; Voltage: 25V; Voltage Rating: 25V; Construction: Flat; Max Operating Temperature: 125°C; Radiation Hardening: No; Depth: 0.5mm; Thickness: 0.022inch; Voltage Rating (DC): 25V; Number of Pins: 2; Lead Free: Lead Free; Series: -; REACH SVHC: No SVHC; Length: 1mm; Dielectric: X7R; RoHS Compliant: Yes; Mount: Surface Mount; Packaging: Tape and Reel; Case/Package: 0402; Case Code (Imperial): 0402; Termination: SMD/SMT; Width: 0.02inch; Case Code (Metric): 1005; Tolerance: 10%
C74 = CMP-2008-02907-1: Manufacturer: AVX Interconnect / Elco; Part Number: 04025C222JAT2A
D4 = CMP-22017-000005-2: LED GREEN CLEAR CHIP SMD; Dominant Wavelength: 569nm; Reverse Voltage: 5V; Lens Color: Colorless; Viewing Angle: 130°; Voltage: 2V; Forward Current: 30mA; Power Dissipation: 100mW; Luminous Intensity: 6mcd; Number of LEDs: 1; Forward Voltage: 2.1V; Wavelength: 565nm; Test Current: 10mA; Min Operating Temperature: -55°C; Lens Style: Clear; Mount: Surface Mount; Width: 0.8mm; Packaging: Tape and Reel; Lens Transparency: Clear; Case Code (Metric): 1608; Depth: 0.8mm; Case Code (Imperial): 0603; Case/Package: 0603; Number of Pins: 2; Max Operating Temperature: 85°C; Lead Free: Lead Free; Number of Elements: 1; Length: 1.6mm; Height: 0.8mm; Package Quantity: 1; Power Rating: 100mW; Radiation Hardening: No; Illumination Color: Green; Color: Green
P1-P4 = CMP-2000-05151-1: CONN RECPT ULTRA-MINI COAX SMD; Manufacturer: Hirose Electric; Centre Contact Resistance: 25mohm; Voltage Rating V AC: 60V; Female Contact Material: PhosphorBronze; Contact Resistance: 10mohm; Male Contact Material: Brass; Connector Type: UFLCoaxial; Connector Mounting: PCB; Impedance: 50ohm; Insulation Resistance: 500Mohm; Secondary Insulation Material: PBT; Frequency Max: 6GHz; Body Plating: Silver; External Length / Height: 2.5mm; Approval Category: UL94V-0; Female Contact Plating: Gold; Connector Mounting Orientation: PCBoard; VSWR: 1.3; Coaxial Termination: Solder; Body Style: StraightJack; SVHC: NoSVHC(18-Jun-2012); Jacket Material: LCP; Package Reference: U.FL-R-SMT(10); Datasheet Version: Feb-04; Outer Contact Resistance: 10mohm; Contact Plating: Gold; Mounting Type: PCBoard; Flammability Rating: UL94V-0; Operating Frequency Max: 6GHz; Termination Method: Solder; Male Contact Plating: Gold; Package Description: 3-Pin Surface Mount Device, Body 2.6 x 2.6 mm; Operating Temperature Min: -40degC; Manufacturer URL: https://www.hirose.com; Operating Temperature Max: 90degC; Contact Material: PhosphorBronze; Datasheet URL: http://www.farnell.com/datasheets/91524.pdf; Material: PhosphorBronze
R16 R17 R24 R26 R35 R36 R44 R63-R71 R74 = CMP-2002-05217-1: Manufacturer: Bourns; Part Number: CR0402-FX-4701GLF
R25 R33 R47 R49 R51 R75 R82-R84 R86 = CMP-2002-04569-1: Manufacturer: KOA Speer; Part Number: RK73Z1ETTP
R76 = CMP-2002-08277-1: Manufacturer: Vishay Dale; Part Number: CRCW04021K00FKTD
R182 = CMP-2002-05853-1: Manufacturer: Panasonic; Part Number: ERA-2AED331X
U4 = 8A34001E-000AJG8: No Description Available; Mfr_Name: Renesas Electronics; Copyright: Copyright (C) 2024 Ultra Librarian. All rights reserved.; Manufacturer_Part_Number: 8A34001E-000AJG8; RefDes: RefDes; Type: DEV
U5 = CMP-0159-01024-1: 1024K bits I2C™ Serial EEPROM, 2.5 to 5.5 V, 400 kHz, -40 to 85 degC, 8-pin SOIC (SN8), Tube; Manufacturer: Microchip; DatasheetVersion: Rev. C; ComponentLink3Description: Package Specification; ComponentLink1URL: http://www.microchip.com; Mounting Technology: Surface Mount; ComponentLink4URL: http://www.microchip.com/24LC1026; ComponentLink2Description: Datasheet; PartNumber: 24LC1026-I/SN; PackageReference: SOIC-SN8; PackageDescription: 8-Lead Plastic Small Outline, 4.9 x 3.9 mm Body, 1.27 mm Pitch; ComponentLink1Description: Manufacturer URL; ComponentLink3URL: http://www.microchip.com/stellent/groups/techpub_sg/documents/packagingspec/en012702.pdf; ComponentLink2URL: http://ww1.microchip.com/downloads/en/DeviceDoc/22270C.pdf; PackageVersion: C04-057C; ComponentLink4Description: Product URL

## Sheet 15-DPLL_2.SchDoc
size C; SheetNumber: 14; SheetTotal: 16
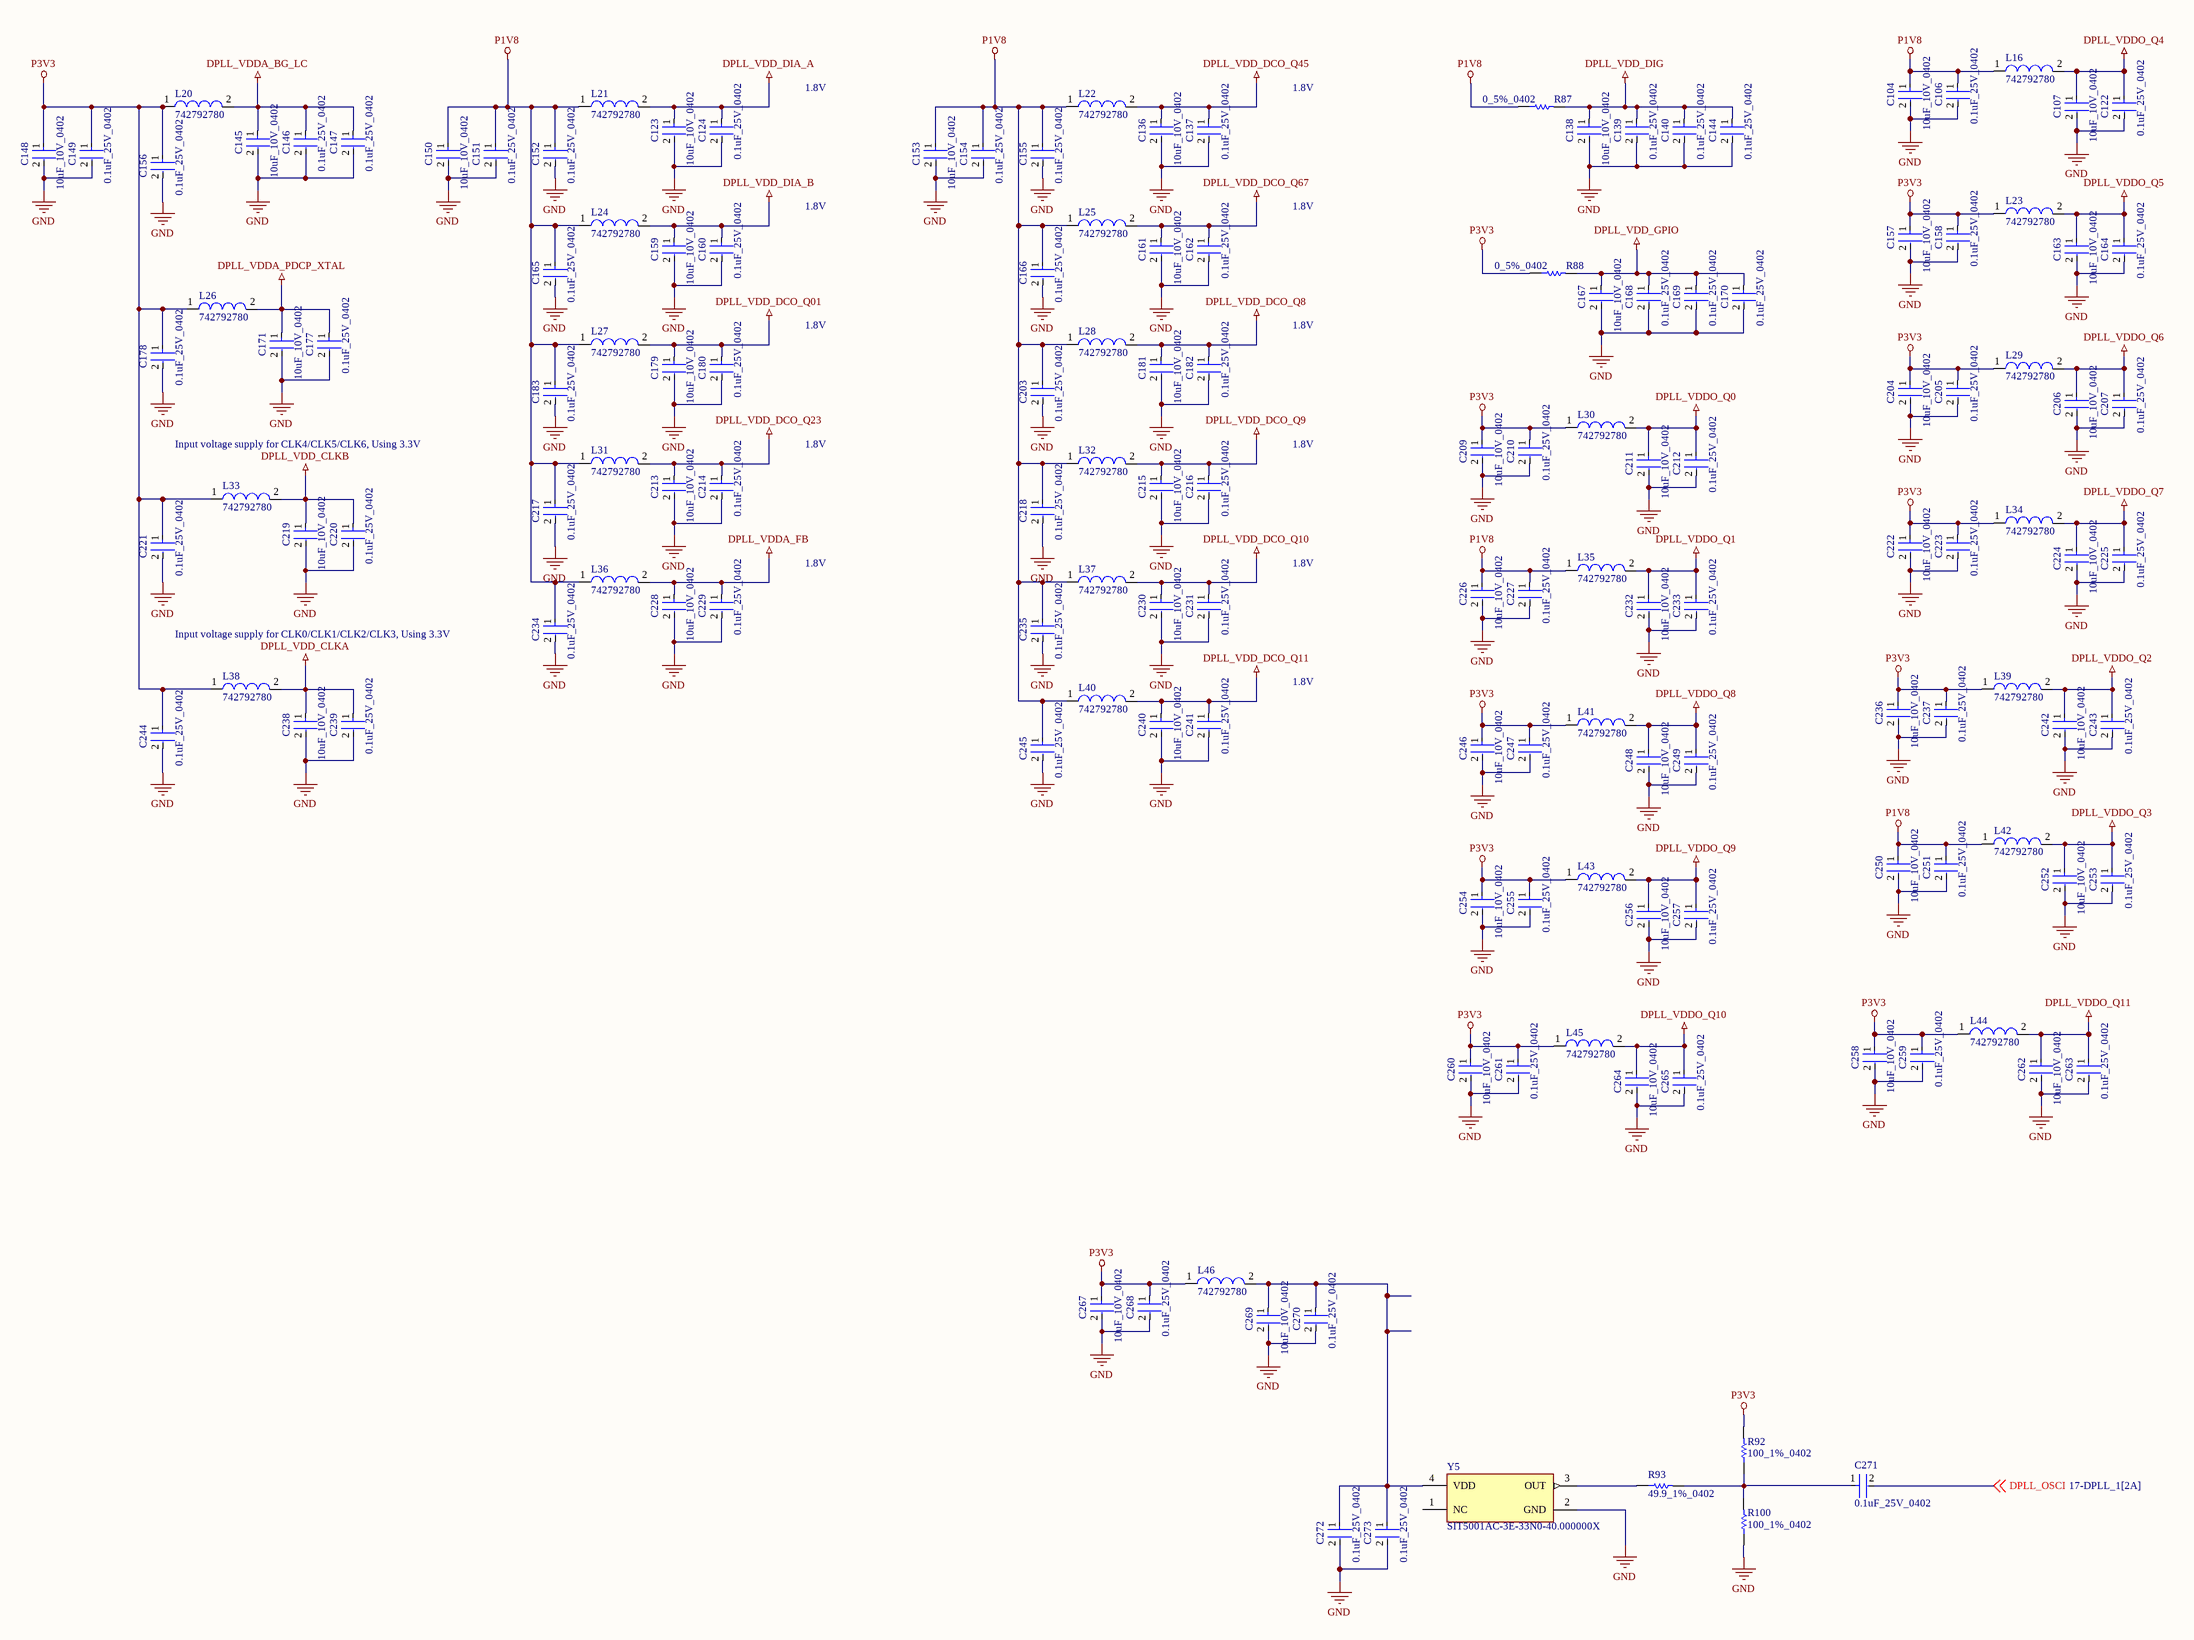
[diagram p9: 15-DPLL_2.SchDoc]

### Parts
C104  10uF_10V_0402  [FP-CL05A106MP5NUNC-MFG]
C106  0.1uF_25V_0402  [FP-0402-L_1_0_1-W_0_5_0_1-IPC_C]
C107  10uF_10V_0402  [FP-CL05A106MP5NUNC-MFG]
C122  0.1uF_25V_0402  [FP-0402-L_1_0_1-W_0_5_0_1-IPC_C]
C123  10uF_10V_0402  [FP-CL05A106MP5NUNC-MFG]
C124  0.1uF_25V_0402  [FP-0402-L_1_0_1-W_0_5_0_1-IPC_C]
C136  10uF_10V_0402  [FP-CL05A106MP5NUNC-MFG]
C137  0.1uF_25V_0402  [FP-0402-L_1_0_1-W_0_5_0_1-IPC_C]
C138  10uF_10V_0402  [FP-CL05A106MP5NUNC-MFG]
C139  0.1uF_25V_0402  [FP-0402-L_1_0_1-W_0_5_0_1-IPC_C]
C140  0.1uF_25V_0402  [FP-0402-L_1_0_1-W_0_5_0_1-IPC_C]
C144  0.1uF_25V_0402  [FP-0402-L_1_0_1-W_0_5_0_1-IPC_C]
C145  10uF_10V_0402  [FP-CL05A106MP5NUNC-MFG]
C146  0.1uF_25V_0402  [FP-0402-L_1_0_1-W_0_5_0_1-IPC_C]
C147  0.1uF_25V_0402  [FP-0402-L_1_0_1-W_0_5_0_1-IPC_C]
C148  10uF_10V_0402  [FP-CL05A106MP5NUNC-MFG]
C149  0.1uF_25V_0402  [FP-0402-L_1_0_1-W_0_5_0_1-IPC_C]
C150  10uF_10V_0402  [FP-CL05A106MP5NUNC-MFG]
C151  0.1uF_25V_0402  [FP-0402-L_1_0_1-W_0_5_0_1-IPC_C]
C152  0.1uF_25V_0402  [FP-0402-L_1_0_1-W_0_5_0_1-IPC_C]
C153  10uF_10V_0402  [FP-CL05A106MP5NUNC-MFG]
C154  0.1uF_25V_0402  [FP-0402-L_1_0_1-W_0_5_0_1-IPC_C]
C155  0.1uF_25V_0402  [FP-0402-L_1_0_1-W_0_5_0_1-IPC_C]
C156  0.1uF_25V_0402  [FP-0402-L_1_0_1-W_0_5_0_1-IPC_C]
C157  10uF_10V_0402  [FP-CL05A106MP5NUNC-MFG]
C158  0.1uF_25V_0402  [FP-0402-L_1_0_1-W_0_5_0_1-IPC_C]
C159  10uF_10V_0402  [FP-CL05A106MP5NUNC-MFG]
C160  0.1uF_25V_0402  [FP-0402-L_1_0_1-W_0_5_0_1-IPC_C]
C161  10uF_10V_0402  [FP-CL05A106MP5NUNC-MFG]
C162  0.1uF_25V_0402  [FP-0402-L_1_0_1-W_0_5_0_1-IPC_C]
C163  10uF_10V_0402  [FP-CL05A106MP5NUNC-MFG]
C164  0.1uF_25V_0402  [FP-0402-L_1_0_1-W_0_5_0_1-IPC_C]
C165  0.1uF_25V_0402  [FP-0402-L_1_0_1-W_0_5_0_1-IPC_C]
C166  0.1uF_25V_0402  [FP-0402-L_1_0_1-W_0_5_0_1-IPC_C]
C167  10uF_10V_0402  [FP-CL05A106MP5NUNC-MFG]
C168  0.1uF_25V_0402  [FP-0402-L_1_0_1-W_0_5_0_1-IPC_C]
C169  0.1uF_25V_0402  [FP-0402-L_1_0_1-W_0_5_0_1-IPC_C]
C170  0.1uF_25V_0402  [FP-0402-L_1_0_1-W_0_5_0_1-IPC_C]
C171  10uF_10V_0402  [FP-CL05A106MP5NUNC-MFG]
C177  0.1uF_25V_0402  [FP-0402-L_1_0_1-W_0_5_0_1-IPC_C]
C178  0.1uF_25V_0402  [FP-0402-L_1_0_1-W_0_5_0_1-IPC_C]
C179  10uF_10V_0402  [FP-CL05A106MP5NUNC-MFG]
C180  0.1uF_25V_0402  [FP-0402-L_1_0_1-W_0_5_0_1-IPC_C]
C181  10uF_10V_0402  [FP-CL05A106MP5NUNC-MFG]
C182  0.1uF_25V_0402  [FP-0402-L_1_0_1-W_0_5_0_1-IPC_C]
C183  0.1uF_25V_0402  [FP-0402-L_1_0_1-W_0_5_0_1-IPC_C]
C203  0.1uF_25V_0402  [FP-0402-L_1_0_1-W_0_5_0_1-IPC_C]
C204  10uF_10V_0402  [FP-CL05A106MP5NUNC-MFG]
C205  0.1uF_25V_0402  [FP-0402-L_1_0_1-W_0_5_0_1-IPC_C]
C206  10uF_10V_0402  [FP-CL05A106MP5NUNC-MFG]
C207  0.1uF_25V_0402  [FP-0402-L_1_0_1-W_0_5_0_1-IPC_C]
C209  10uF_10V_0402  [FP-CL05A106MP5NUNC-MFG]
C210  0.1uF_25V_0402  [FP-0402-L_1_0_1-W_0_5_0_1-IPC_C]
C211  10uF_10V_0402  [FP-CL05A106MP5NUNC-MFG]
C212  0.1uF_25V_0402  [FP-0402-L_1_0_1-W_0_5_0_1-IPC_C]
C213  10uF_10V_0402  [FP-CL05A106MP5NUNC-MFG]
C214  0.1uF_25V_0402  [FP-0402-L_1_0_1-W_0_5_0_1-IPC_C]
C215  10uF_10V_0402  [FP-CL05A106MP5NUNC-MFG]
C216  0.1uF_25V_0402  [FP-0402-L_1_0_1-W_0_5_0_1-IPC_C]
C217  0.1uF_25V_0402  [FP-0402-L_1_0_1-W_0_5_0_1-IPC_C]
C218  0.1uF_25V_0402  [FP-0402-L_1_0_1-W_0_5_0_1-IPC_C]
C219  10uF_10V_0402  [FP-CL05A106MP5NUNC-MFG]
C220  0.1uF_25V_0402  [FP-0402-L_1_0_1-W_0_5_0_1-IPC_C]
C221  0.1uF_25V_0402  [FP-0402-L_1_0_1-W_0_5_0_1-IPC_C]
C222  10uF_10V_0402  [FP-CL05A106MP5NUNC-MFG]
C223  0.1uF_25V_0402  [FP-0402-L_1_0_1-W_0_5_0_1-IPC_C]
C224  10uF_10V_0402  [FP-CL05A106MP5NUNC-MFG]
C225  0.1uF_25V_0402  [FP-0402-L_1_0_1-W_0_5_0_1-IPC_C]
C226  10uF_10V_0402  [FP-CL05A106MP5NUNC-MFG]
C227  0.1uF_25V_0402  [FP-0402-L_1_0_1-W_0_5_0_1-IPC_C]
C228  10uF_10V_0402  [FP-CL05A106MP5NUNC-MFG]
C229  0.1uF_25V_0402  [FP-0402-L_1_0_1-W_0_5_0_1-IPC_C]
C230  10uF_10V_0402  [FP-CL05A106MP5NUNC-MFG]
C231  0.1uF_25V_0402  [FP-0402-L_1_0_1-W_0_5_0_1-IPC_C]
C232  10uF_10V_0402  [FP-CL05A106MP5NUNC-MFG]
C233  0.1uF_25V_0402  [FP-0402-L_1_0_1-W_0_5_0_1-IPC_C]
C234  0.1uF_25V_0402  [FP-0402-L_1_0_1-W_0_5_0_1-IPC_C]
C235  0.1uF_25V_0402  [FP-0402-L_1_0_1-W_0_5_0_1-IPC_C]
C236  10uF_10V_0402  [FP-CL05A106MP5NUNC-MFG]
C237  0.1uF_25V_0402  [FP-0402-L_1_0_1-W_0_5_0_1-IPC_C]
C238  10uF_10V_0402  [FP-CL05A106MP5NUNC-MFG]
C239  0.1uF_25V_0402  [FP-0402-L_1_0_1-W_0_5_0_1-IPC_C]
C240  10uF_10V_0402  [FP-CL05A106MP5NUNC-MFG]
C241  0.1uF_25V_0402  [FP-0402-L_1_0_1-W_0_5_0_1-IPC_C]
C242  10uF_10V_0402  [FP-CL05A106MP5NUNC-MFG]
C243  0.1uF_25V_0402  [FP-0402-L_1_0_1-W_0_5_0_1-IPC_C]
C244  0.1uF_25V_0402  [FP-0402-L_1_0_1-W_0_5_0_1-IPC_C]
C245  0.1uF_25V_0402  [FP-0402-L_1_0_1-W_0_5_0_1-IPC_C]
C246  10uF_10V_0402  [FP-CL05A106MP5NUNC-MFG]
C247  0.1uF_25V_0402  [FP-0402-L_1_0_1-W_0_5_0_1-IPC_C]
C248  10uF_10V_0402  [FP-CL05A106MP5NUNC-MFG]
C249  0.1uF_25V_0402  [FP-0402-L_1_0_1-W_0_5_0_1-IPC_C]
C250  10uF_10V_0402  [FP-CL05A106MP5NUNC-MFG]
C251  0.1uF_25V_0402  [FP-0402-L_1_0_1-W_0_5_0_1-IPC_C]
C252  10uF_10V_0402  [FP-CL05A106MP5NUNC-MFG]
C253  0.1uF_25V_0402  [FP-0402-L_1_0_1-W_0_5_0_1-IPC_C]
C254  10uF_10V_0402  [FP-CL05A106MP5NUNC-MFG]
C255  0.1uF_25V_0402  [FP-0402-L_1_0_1-W_0_5_0_1-IPC_C]
C256  10uF_10V_0402  [FP-CL05A106MP5NUNC-MFG]
C257  0.1uF_25V_0402  [FP-0402-L_1_0_1-W_0_5_0_1-IPC_C]
C258  10uF_10V_0402  [FP-CL05A106MP5NUNC-MFG]
C259  0.1uF_25V_0402  [FP-0402-L_1_0_1-W_0_5_0_1-IPC_C]
C260  10uF_10V_0402  [FP-CL05A106MP5NUNC-MFG]
C261  0.1uF_25V_0402  [FP-0402-L_1_0_1-W_0_5_0_1-IPC_C]
C262  10uF_10V_0402  [FP-CL05A106MP5NUNC-MFG]
C263  0.1uF_25V_0402  [FP-0402-L_1_0_1-W_0_5_0_1-IPC_C]
C264  10uF_10V_0402  [FP-CL05A106MP5NUNC-MFG]
C265  0.1uF_25V_0402  [FP-0402-L_1_0_1-W_0_5_0_1-IPC_C]
C267  10uF_10V_0402  [FP-CL05A106MP5NUNC-MFG]
C268  0.1uF_25V_0402  [FP-0402-L_1_0_1-W_0_5_0_1-IPC_C]
C269  10uF_10V_0402  [FP-CL05A106MP5NUNC-MFG]
C270  0.1uF_25V_0402  [FP-0402-L_1_0_1-W_0_5_0_1-IPC_C]
C271  0.1uF_25V_0402  [FP-0402-L_1_0_1-W_0_5_0_1-IPC_C]
C272  0.1uF_25V_0402  [FP-0402-L_1_0_1-W_0_5_0_1-IPC_C]
C273  0.1uF_25V_0402  [FP-0402-L_1_0_1-W_0_5_0_1-IPC_C]
L16  742792780  [SMD-0402]
L20  742792780  [SMD-0402]
L21  742792780  [SMD-0402]
L22  742792780  [SMD-0402]
L23  742792780  [SMD-0402]
L24  742792780  [SMD-0402]
L25  742792780  [SMD-0402]
L26  742792780  [SMD-0402]
L27  742792780  [SMD-0402]
L28  742792780  [SMD-0402]
L29  742792780  [SMD-0402]
L30  742792780  [SMD-0402]
L31  742792780  [SMD-0402]
L32  742792780  [SMD-0402]
L33  742792780  [SMD-0402]
L34  742792780  [SMD-0402]
L35  742792780  [SMD-0402]
L36  742792780  [SMD-0402]
L37  742792780  [SMD-0402]
L38  742792780  [SMD-0402]
L39  742792780  [SMD-0402]
L40  742792780  [SMD-0402]
L41  742792780  [SMD-0402]
L42  742792780  [SMD-0402]
L43  742792780  [SMD-0402]
L44  742792780  [SMD-0402]
L45  742792780  [SMD-0402]
L46  742792780  [SMD-0402]
R87  0_5%_0402  [RESC1005X40X25LL10T10]
R88  0_5%_0402  [RESC1005X40X25LL10T10]
R92  100_1%_0402  [RESC1005X40X25ML05T10]
R93  49.9_1%_0402  [RESC1005X40X25NL10T10]
R100  100_1%_0402  [RESC1005X40X25ML05T10]
Y5  SIT5001AC-3E-33N0-40.000000X  [FP-SiT5001-3-MFG]

### Nets
DPLL_VDD_CLKA: C238.1 C239.1 L38.2
DPLL_VDD_CLKB: C219.1 C220.1 L33.2
DPLL_VDD_DCO_Q01: C179.1 C180.1 L27.2
DPLL_VDD_DCO_Q8: C181.1 C182.1 L28.2
DPLL_VDD_DCO_Q9: C215.1 C216.1 L32.2
DPLL_VDD_DCO_Q10: C230.1 C231.1 L37.2
DPLL_VDD_DCO_Q11: C240.1 C241.1 L40.2
DPLL_VDD_DCO_Q23: C213.1 C214.1 L31.2
DPLL_VDD_DCO_Q45: C136.1 C137.1 L22.2
DPLL_VDD_DCO_Q67: C161.1 C162.1 L25.2
DPLL_VDD_DIA_A: C123.1 C124.1 L21.2
DPLL_VDD_DIA_B: C159.1 C160.1 L24.2
DPLL_VDD_DIG: C138.1 C139.1 C140.1 C144.1 R87.2
DPLL_VDD_GPIO: C167.1 C168.1 C169.1 C170.1 R88.2
DPLL_VDDA_BG_LC: C145.1 C146.1 C147.1 L20.2
DPLL_VDDA_FB: C228.1 C229.1 L36.2
DPLL_VDDA_PDCP_XTAL: C171.1 C177.1 L26.2
DPLL_VDDO_Q0: C211.1 C212.1 L30.2
DPLL_VDDO_Q1: C232.1 C233.1 L35.2
DPLL_VDDO_Q2: C242.1 C243.1 L39.2
DPLL_VDDO_Q3: C252.1 C253.1 L42.2
DPLL_VDDO_Q4: C107.1 C122.1 L16.2
DPLL_VDDO_Q5: C163.1 C164.1 L23.2
DPLL_VDDO_Q6: C206.1 C207.1 L29.2
DPLL_VDDO_Q7: C224.1 C225.1 L34.2
DPLL_VDDO_Q8: C248.1 C249.1 L41.2
DPLL_VDDO_Q9: C256.1 C257.1 L43.2
DPLL_VDDO_Q10: C264.1 C265.1 L45.2
DPLL_VDDO_Q11: C262.1 C263.1 L44.2
GND: C104.2 C106.2 C107.2 C122.2 C123.2 C124.2 C136.2 C137.2 C138.2 C139.2 C140.2 C144.2 C145.2 C146.2 C147.2 C148.2 C149.2 C150.2 C151.2 C152.2 C153.2 C154.2 C155.2 C156.2 C157.2 C158.2 C159.2 C160.2 C161.2 C162.2 C163.2 C164.2 C165.2 C166.2 C167.2 C168.2 C169.2 C170.2 C171.2 C177.2 C178.2 C179.2 C180.2 C181.2 C182.2 C183.2 C203.2 C204.2 C205.2 C206.2 C207.2 C209.2 C210.2 C211.2 C212.2 C213.2 C214.2 C215.2 C216.2 C217.2 C218.2 C219.2 C220.2 C221.2 C222.2 C223.2 C224.2 C225.2 C226.2 C227.2 C228.2 C229.2 C230.2 C231.2 C232.2 C233.2 C234.2 C235.2 C236.2 C237.2 C238.2 C239.2 C240.2 C241.2 C242.2 C243.2 C244.2 C245.2 C246.2 C247.2 C248.2 C249.2 C250.2 C251.2 C252.2 C253.2 C254.2 C255.2 C256.2 C257.2 C258.2 C259.2 C260.2 C261.2 C262.2 C263.2 C264.2 C265.2 C267.2 C268.2 C269.2 C270.2 C272.2 C273.2 R100.1 Y5.2(GND)
P1V8: C104.1 C106.1 C150.1 C151.1 C152.1 C153.1 C154.1 C155.1 C165.1 C166.1 C183.1 C203.1 C217.1 C218.1 C226.1 C227.1 C234.1 C235.1 C245.1 C250.1 C251.1 L16.1 L21.1 L22.1 L24.1 L25.1 L27.1 L28.1 L31.1 L32.1 L35.1 L36.1 L37.1 L40.1 L42.1 R87.1
P3V3: C148.1 C149.1 C156.1 C157.1 C158.1 C178.1 C204.1 C205.1 C209.1 C210.1 C221.1 C222.1 C223.1 C236.1 C237.1 C244.1 C246.1 C247.1 C254.1 C255.1 C258.1 C259.1 C260.1 C261.1 C267.1 C268.1 L20.1 L23.1 L26.1 L29.1 L30.1 L33.1 L34.1 L38.1 L39.1 L41.1 L43.1 L44.1 L45.1 L46.1 R88.1 R92.2
DPLL_OSCI: C271.2 ; off-sheet DPLL_OSCI
NetC269_1: C269.1 C270.1 C272.1 C273.1 L46.2 Y5.4(VDD)
NetC271_1: C271.1 R92.1 R93.2 R100.2
NetR93_1: R93.1 Y5.3(OUT)

Not connected (* = marked no-connect by the designer): Y5 1(NC)

### Notes on the sheet
- 1.8V
- Input voltage supply for CLK4/CLK5/CLK6, Using 3.3V
- Input voltage supply for CLK0/CLK1/CLK2/CLK3, Using 3.3V

### Library data of the parts
C104 C107 C123 C136 C138 C145 C148 C150 C153 C157 C159 C161 C163 C167 C171 C179 C181 C204 C206 C209 C211 C213 C215 C219 C222 C224 C226 C228 C230 C232 C236 C238 C240 C242 C246 C248 C250 C252 C254 C256 C258 C260 C262 C264 C267 C269 = CMP-13271-000002-1: as C7 on sheet 14-DPLL_1; Octopart: https://octopart.com/cl05a106mp5nunc-samsung-22457395; Voltage Rating: 10V; RoHS: TRUE; Value: 10uF; Height: 0.7mm; Digikey Description: CAP CER 10UF 10V X5R 0402; Automotive: No; Package: CL05A106MP5NUNC; Device Class L1: Passive Components; Capacitance: 10uF; Temperature Range High: +85°C; ComponentLink2Description: Datasheet; Device Class L2: Capacitors; Temperature Characteristic: X5R; Temperature: -55°C to +85°C; ComponentLink2URL: http://www.samsungsem.com/kr/support/product-search/mlcc/__icsFiles/afieldfile/2019/05/10/19-CL05A106MP5NUNC.pdf; Device Class L3: Ceramic Capacitors; Category: Cap; Temperature Range Low: -55°C; Ipc Land Pattern Name: CAPC10050X50; Lead Free: Yes
C106 C122 C124 C137 C139 C140 C144 C146 C147 C149 C151 C152 C154-C156 C158 C160 C162 C164-C166 C168-C170 C177 C178 C180 C182 C183 C203 C205 C207 C210 C212 C214 C216-C218 C220 C221 C223 C225 C227 C229 C231 C233-C235 C237 C239 C241 C243-C245 C247 C249 C251 C253 C255 C257 C259 C261 C263 C265 C268 C270-C273 = CMP-2008-02519-2: as C28 on sheet 14-DPLL_1; Package Quantity: 1; Capacitance: 100nF; Min Operating Temperature: -55°C; Voltage: 25V; Voltage Rating: 25V; Construction: Flat; Max Operating Temperature: 125°C; Radiation Hardening: No; Depth: 0.5mm; Thickness: 0.022inch; Voltage Rating (DC): 25V; Number of Pins: 2; Lead Free: Lead Free; Series: -; REACH SVHC: No SVHC; Length: 1mm; Dielectric: X7R; RoHS Compliant: Yes; Mount: Surface Mount; Packaging: Tape and Reel; Case/Package: 0402; Case Code (Imperial): 0402; Termination: SMD/SMT; Width: 0.02inch; Case Code (Metric): 1005; Tolerance: 10%
L16 L20-L46 = CMP-0220-00137-1: SMD EMI Suppression Ferrite Bead WE-CBF, Z = 220 Ohm; Impedance: 220 Ohm; PackageVersion: 2009; DatasheetVersion: ver 4, Jul-2009; PackageDescription: Chip Inductor, 2-Leads, Body 1.0 x 0.5 mm; ComponentLink1URL: http://www.we-online.com; ComponentLink1Description: Manufacturer Link; ComponentLink2URL: http://www.we-online.de/katalog/media/pdf/742792780.pdf; PackageReference: SMD-0402; ComponentLink2Description: Datasheet
R87 R88 = CMP-2002-04569-1: as R25 on sheet 14-DPLL_1
R92 R100 = CMP-2002-06458-1: Part Number: ERJ-U02F1000X; Manufacturer: Panasonic
R93 = CMP-2002-04448-1: Part Number: RK73H1ETTP49R9F; Manufacturer: KOA Speer
Y5 = CMP-25159-259584-1: MEMS OSC TCXO 40.0000MHZ LVCMOS; Frequency Stability: 5ppm; Max Supply Current: 33mA; Frequency: 40MHz; Case/Package: SMD/SMT; Packaging: Cut Tape; Min Operating Temperature: -20°C; Mount: Surface Mount; Length: 0.197inch; Series: SiT5001; Max Operating Temperature: 70°C; Height: 0.031inch; Width: 0.126inch